# Altium project ECU.PrjPcb (part 1 of 2)
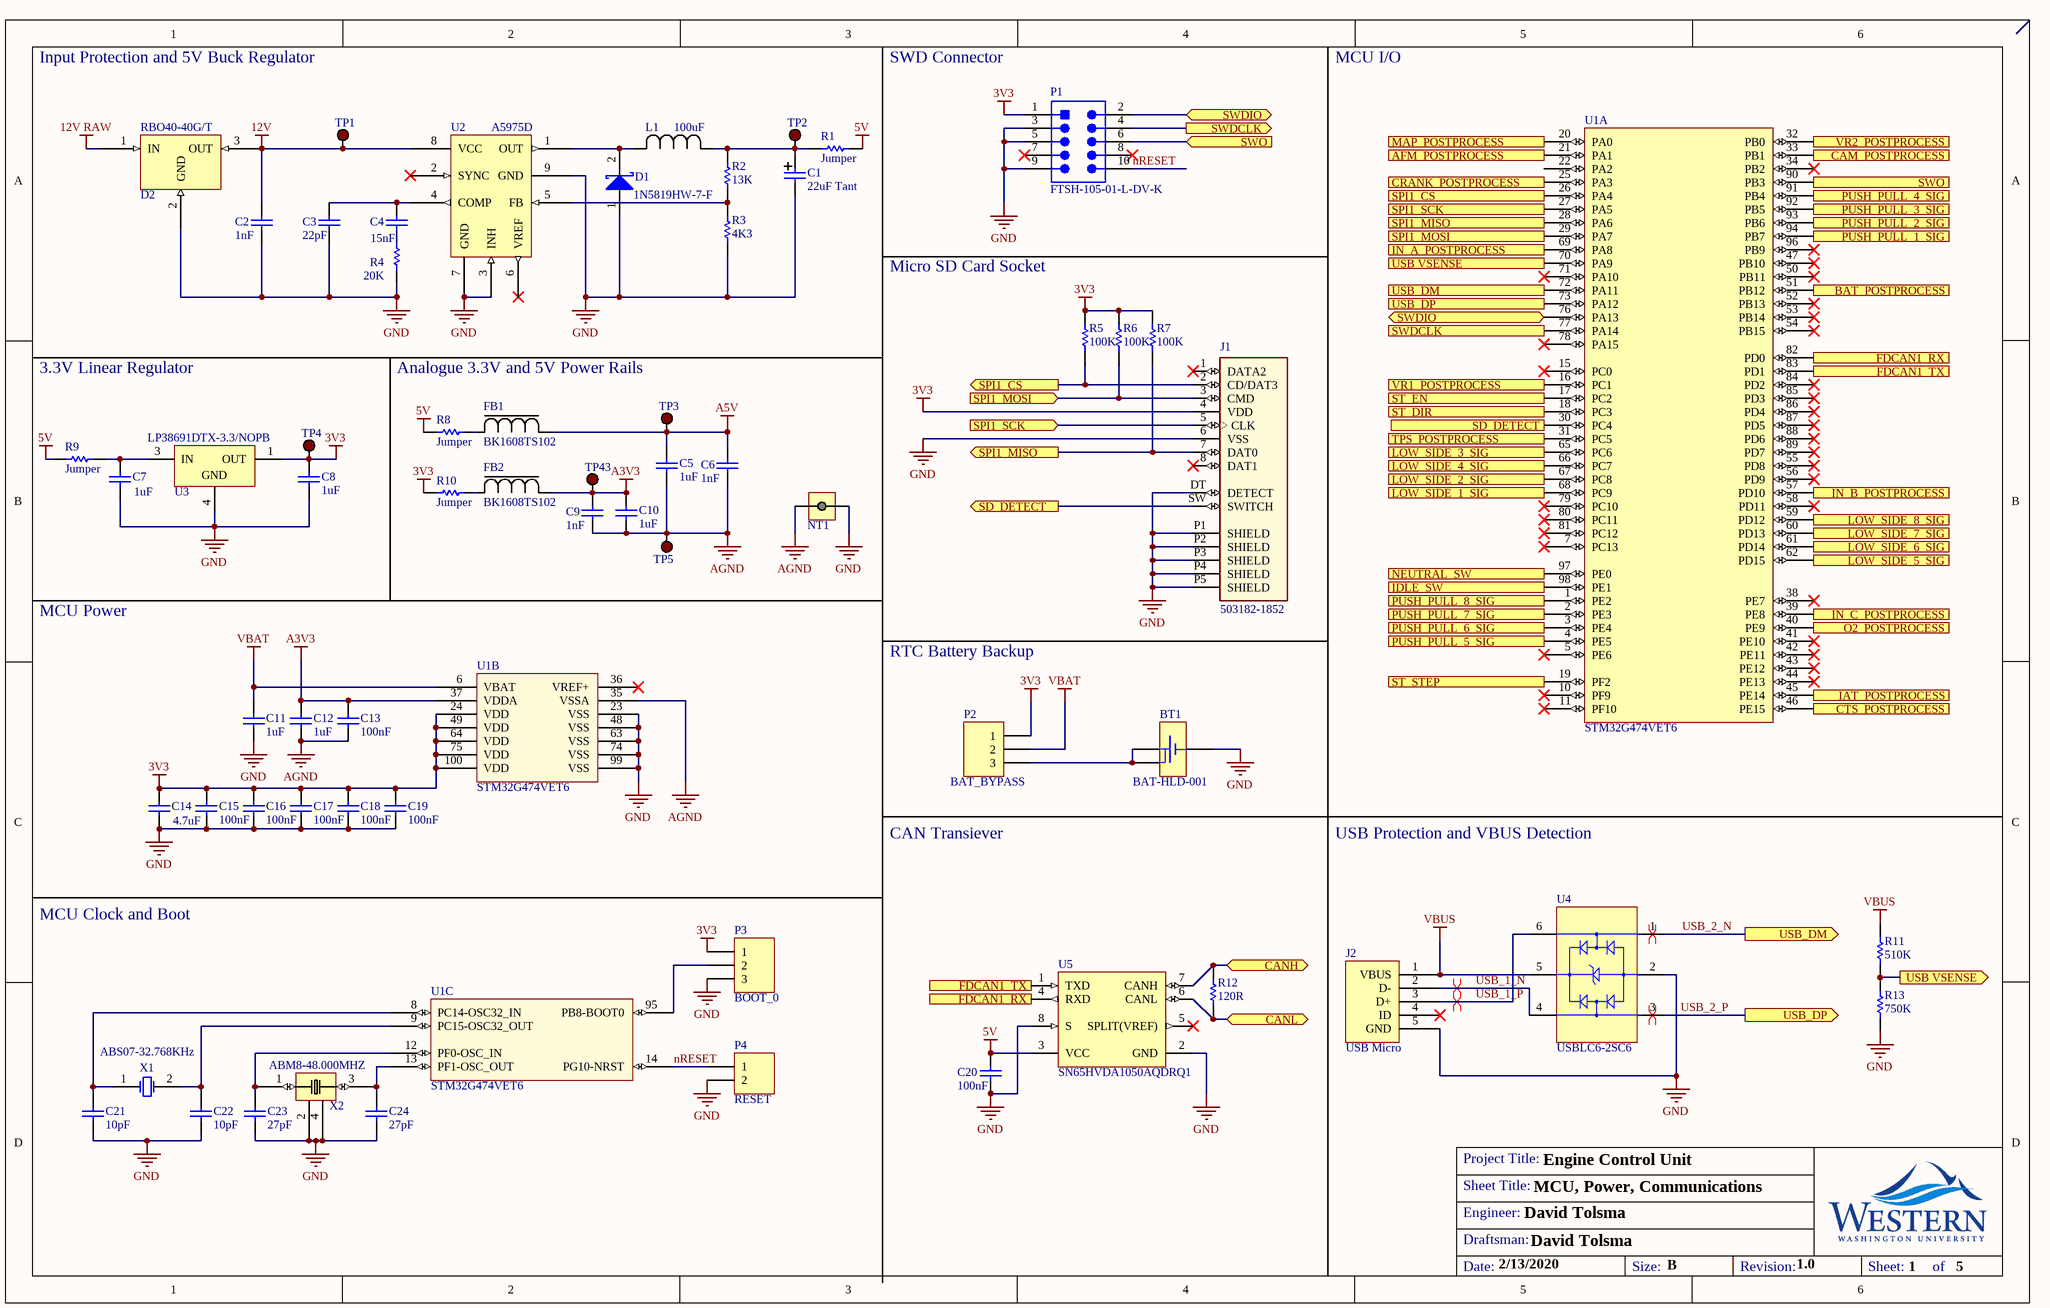
[diagram p0: Power_Communications_MCU.SchDoc]
DraftsmanName: David Tolsma; EngineerName: David Tolsma; GlobalDate: 2/13/2020; GlobalTitle: Engine Control Unit; RevNumber: 1.0
5 sheets, 338 parts. Net scope: global (net labels, ports and power ports of the same name join across sheets).
Board file: ECU.PcbDoc
Sheets:
  Power_Communications_MCU.SchDoc
  Low_Side_Drivers.SchDoc
  Op_Amp_Sig_Process.SchDoc
  Push_Pull_Drivers.SchDoc
  Op_Amp_Sig_Process_Off-Board_Connector_Etc.SchDoc

## Sheet Power_Communications_MCU.SchDoc: MCU, Power, Communications
size B; Date: [Date]; SheetNumber: 1; SheetTotal: 5

### Parts
BT1  BAT-HLD-001  [BATHLD-001]
C1  22uF Tant  [CAPC1210(3225)280_L]
C2  1nF  [CAPC0603(1608)100_N]
C3  22pF  [CAPC0603(1608)100_M]
C4  15nF  [CAPC0603(1608)100_M]
C5  1uF  [CAPC0603(1608)100_M]
C6  1nF  [CAPC0603(1608)100_M]
C7  1uF  [CAPC0603(1608)100_M]
C8  1uF  [CAPC0603(1608)100_M]
C9  1nF  [CAPC0603(1608)100_M]
C10  1uF  [CAPC0603(1608)100_M]
C11  1uF  [CAPC0603(1608)100_L]
C12  1uF  [CAPC0603(1608)100_L]
C13  100nF  [CAPC0603(1608)100_L]
C14  4.7uF  [CAPC0603(1608)55_L]
C15  100nF  [CAPC0603(1608)100_L]
C16  100nF  [CAPC0603(1608)100_L]
C17  100nF  [CAPC0603(1608)100_L]
C18  100nF  [CAPC0603(1608)100_L]
C19  100nF  [CAPC0603(1608)100_L]
C20  100nF  [CAPC0603(1608)100_M]
C21  10pF  [CAPC0603(1608)100_L]
C22  10pF  [CAPC0603(1608)100_L]
C23  27pF  [CAPC0603(1608)100_M]
C24  27pF  [CAPC0603(1608)100_M]
D1  1N5819HW-7-F  [DIOD-SOD-123-2_V]
D2  RBO40-40G/T  [D2PAK-L]
FB1  BK1608TS102  [BK1608TS102-T]
FB2  BK1608TS102  [BK1608TS102-T]
J1  503182-1852  [*MOLEX_503182-1852_503182-1852(Primary)]
J2  USB Micro  [USB_CONN]
L1  100uF  [IND_BOURNS_SRR1260-101M]
NT1  NET TIE 0603  [NetTie0603]  (value not drawn)  (net tie, no BOM)
P1  FTSH-105-01-L-DV-K  [SMTC-FTSH-105-01-L-DV-K_V]
P2  BAT_BYPASS  [HDR1X3]
P3  BOOT_0  [HDR1X3]
P4  RESET  [HDR1X2]
R1  Jumper  [RESC0603(1608)_N]
R2  13K  [RESC0603(1608)_M]
R3  4K3  [RESC0603(1608)_M]
R4  20K  [RESC0603(1608)_M]
R5  100K  [RESC0603(1608)_N]
R6  100K  [RESC0603(1608)_N]
R7  100K  [RESC0603(1608)_N]
R8  Jumper  [RESC0603(1608)_N]
R9  Jumper  [RESC0603(1608)_M]
R10  Jumper  [RESC0603(1608)_N]
R11  510K  [RESC0603(1608)_M]
R12  120R  [RESC0603(1608)_L]
R13  750K  [RESC0603(1608)_M]
TP1  5001  [Keystone_5001]  (value not drawn)
TP2  5001  [Keystone_5001]  (value not drawn)
TP3  5001  [Keystone_5001]  (value not drawn)
TP4  5001  [Keystone_5001]  (value not drawn)
TP5  5001  [Keystone_5001]  (value not drawn)
TP43  5001  [Keystone_5001]  (value not drawn)
U1  STM32G474VET6  [STM32G474VET6]  (parts A,B,C of 3)
U2  A5975D  [A5975D_Medium_Density]
U3  LP38691DTX-3.3/NOPB  [TD03B_M]
U4  USBLC6-2SC6  [USBLC6-2SC6]
U5  SN65HVDA1050AQDRQ1  [D8_L]
X1  ABS07-32.768KHz  [ABRA-ABS07-2_V]
X2  ABM8-48.000MHZ  [ABM8-48.000MHZ-10-1-U-T]

### Ports
AFM_POSTPROCESS (in), BAT_POSTPROCESS (in), CAM_POSTPROCESS (in), CANH (bidir), CANL (bidir), CRANK_POSTPROCESS (in), CTS_POSTPROCESS (in), FDCAN1_RX (in), FDCAN1_RX (out), FDCAN1_TX (in), FDCAN1_TX (out), IAT_POSTPROCESS (in), IDLE_SW (out), IN_A_POSTPROCESS (in), IN_B_POSTPROCESS (in), IN_C_POSTPROCESS (in), LOW_SIDE_1_SIG (out), LOW_SIDE_2_SIG (out), LOW_SIDE_3_SIG (out), LOW_SIDE_4_SIG (out), LOW_SIDE_5_SIG (out), LOW_SIDE_6_SIG (out), LOW_SIDE_7_SIG (out), LOW_SIDE_8_SIG (out), MAP_POSTPROCESS (in), NEUTRAL_SW (out), O2_POSTPROCESS (in), PUSH_PULL_1_SIG (out), PUSH_PULL_2_SIG (out), PUSH_PULL_3_SIG (out), PUSH_PULL_4_SIG (out), PUSH_PULL_5_SIG (out), PUSH_PULL_6_SIG (out), PUSH_PULL_7_SIG (out), PUSH_PULL_8_SIG (out), SD_DETECT (in), SD_DETECT (out), SPI1_CS (out), SPI1_MISO (in), SPI1_MISO (out), SPI1_MOSI (in), SPI1_MOSI (out), SPI1_SCK (in), SPI1_SCK (out), ST_DIR (out), ST_EN (out), ST_STEP (out), SWDCLK (in), SWDCLK (out), SWDIO (bidir), SWO (in), SWO (out), TPS_POSTPROCESS (in), USB VSENSE (in), USB VSENSE (out), USB_DM (out), USB_DP (out), VR1_POSTPROCESS (in), VR2_POSTPROCESS (in)

### Nets
3V3: C8.2 C14.2 C15.2 C16.2 C17.2 C18.2 C19.2 J1.4(VDD) P1.1 P2.1 P3.1 R5.2 R6.2 R7.2 R10.1 TP4.1(TP) U1.24(VDD) U1.49(VDD) U1.64(VDD) U1.75(VDD) U1.100(VDD) U3.1(OUT)
5V: C20.2 R1.2 R8.1 R9.1 U5.3(VCC)
12V: C2.1 D2.3(OUT) TP1.1(TP) U2.8(VCC)
12V RAW: D2.1(IN)
A3V3: C9.1 C10.2 C12.2 C13.2 FB2.1 TP43.1(TP) U1.37(VDDA)
A5V: C5.2 C6.1 FB1.1 TP3.1(TP)
AGND: C5.1 C6.2 C9.2 C10.1 C12.1 C13.1 NT1.1 TP5.1(TP) U1.35(VSSA)
GND: BT1.1(-) C1.1 C2.2 C3.1 C7.1 C8.1 C11.1 C14.1 C15.1 C16.1 C17.1 C18.1 C19.1 C20.1 C21.1 C22.1 C23.1 C24.1 D1.1(A) D2.2(GND) J1.6(VSS) J1.DT(DETECT) J1.P1(SHIELD) J1.P2(SHIELD) J1.P3(SHIELD) J1.P4(SHIELD) J1.P5(SHIELD) J2.5(GND) NT1.2 P1.3 P1.5 P1.9 P3.3 P4.2 R3.2 R4.1 R13.1 U1.23(VSS) U1.48(VSS) U1.63(VSS) U1.74(VSS) U1.99(VSS) U2.3(INH) U2.7(GND) U2.9(GND) U3.4(GND) U4.2(GND) U5.2(GND) U5.8(S) X2.2 X2.4
VBAT: C11.2 P2.2 U1.6(VBAT)
VBUS: J2.1(VBUS) R11.2 U4.5(VBUS)
nRESET: P1.10 P4.1 U1.14(PG10-NRST)
USB_1_N: J2.2(D-) U4.4(I/O_3)
USB_1_P: J2.3(D+) U4.6(I/O_4)
USB_2_N: U1.72(PA11) U4.1(I/O_1) ; port USB_DM
USB_2_P: U1.73(PA12) U4.3(I/O_2) ; port USB_DP
NetBT1_2: BT1.2(+) BT1.3(+) P2.3
NetC1_2: C1.2 L1.1 R1.1 R2.2 TP2.1(TP)
NetC3_2: C3.2 C4.2 U2.4(COMP)
NetC4_1: C4.1 R4.2
NetC7_2: C7.2 R9.2 U3.3(IN)
NetC21_2: C21.2 U1.8(PC14-OSC32_IN) X1.1(X1)
NetC22_2: C22.2 U1.9(PC15-OSC32_OUT) X1.2(X2)
NetC23_2: C23.2 U1.12(PF0-OSC_IN) X2.1
NetC24_2: C24.2 U1.13(PF1-OSC_OUT) X2.3
NetD1_2: D1.2(K) L1.2 U2.1(OUT)
NetD38_3: U1.97(PE0) ; port NEUTRAL_SW
NetD40_3: U1.98(PE1) ; port IDLE_SW
NetFB1_2: FB1.2 R8.2
NetFB2_2: FB2.2 R10.2
NetJ1_2: J1.2(CD/DAT3) R5.1 U1.26(PA4) ; port SPI1_CS
NetJ1_3: J1.3(CMD) R6.1 U1.29(PA7) ; port SPI1_MOSI
NetJ1_5: J1.5(CLK) U1.27(PA5) ; port SPI1_SCK
NetJ1_7: J1.7(DAT0) R7.1 U1.28(PA6) ; port SPI1_MISO
NetJ1_SW: J1.SW(SWITCH) U1.30(PC4) ; port SD_DETECT
NetP1_2: P1.2 U1.76(PA13) ; port SWDIO
NetP1_4: P1.4 U1.77(PA14) ; port SWDCLK
NetP1_6: P1.6 U1.90(PB3) ; port SWO
NetP3_2: P3.2 U1.95(PB8-BOOT0)
NetR2_1: R2.1 R3.1 U2.5(FB)
NetR11_1: R11.1 R13.2 U1.70(PA9) ; port USB VSENSE
NetR12_1: R12.1 U5.6(CANL) ; port CANL
NetR12_2: R12.2 U5.7(CANH) ; port CANH
NetR20_2: U1.68(PC9) ; port LOW_SIDE_1_SIG
NetR21_2: U1.65(PC6) ; port LOW_SIDE_3_SIG
NetR24_2: U1.67(PC8) ; port LOW_SIDE_2_SIG
NetR25_2: U1.66(PC7) ; port LOW_SIDE_4_SIG
NetR36_2: U1.62(PD15) ; port LOW_SIDE_5_SIG
NetR37_2: U1.60(PD13) ; port LOW_SIDE_7_SIG
NetR40_2: U1.61(PD14) ; port LOW_SIDE_6_SIG
NetR41_2: U1.59(PD12) ; port LOW_SIDE_8_SIG
NetR50_2: U1.31(PC5) ; port TPS_POSTPROCESS
NetR51_2: U1.33(PB1) ; port CAM_POSTPROCESS
NetR60_2: U1.25(PA3) ; port CRANK_POSTPROCESS
NetR61_2: U1.20(PA0) ; port MAP_POSTPROCESS
NetR70_2: U1.45(PE14) ; port IAT_POSTPROCESS
NetR71_2: U1.21(PA1) ; port AFM_POSTPROCESS
NetR80_2: U1.46(PE15) ; port CTS_POSTPROCESS
NetR81_2: U1.40(PE9) ; port O2_POSTPROCESS
NetR90_2: U1.94(PB7) ; port PUSH_PULL_1_SIG
NetR91_2: U1.92(PB5) ; port PUSH_PULL_3_SIG
NetR98_2: U1.93(PB6) ; port PUSH_PULL_2_SIG
NetR99_2: U1.91(PB4) ; port PUSH_PULL_4_SIG
NetR106_2: U1.4(PE5) ; port PUSH_PULL_5_SIG
NetR107_2: U1.2(PE3) ; port PUSH_PULL_7_SIG
NetR114_2: U1.3(PE4) ; port PUSH_PULL_6_SIG
NetR115_2: U1.1(PE2) ; port PUSH_PULL_8_SIG
NetR119_1: U1.16(PC1) ; port VR1_POSTPROCESS
NetR122_1: U1.32(PB0) ; port VR2_POSTPROCESS
NetR125_2: U1.51(PB12) ; port BAT_POSTPROCESS
NetR136_2: U1.69(PA8) ; port IN_A_POSTPROCESS
NetR141_2: U1.57(PD10) ; port IN_B_POSTPROCESS
NetR148_2: U1.39(PE8) ; port IN_C_POSTPROCESS
NetU1_17: U1.17(PC2) ; port ST_EN
NetU1_18: U1.18(PC3) ; port ST_DIR
NetU1_19: U1.19(PF2) ; port ST_STEP
NetU1_82: U1.82(PD0) U5.4(RXD) ; port FDCAN1_RX
NetU1_83: U1.83(PD1) U5.1(TXD) ; port FDCAN1_TX

Not connected (* = marked no-connect by the designer): J1 1(DATA2)* 8(DAT1)*; J2 4(ID)*; P1 7* 8*; U1 5(PE6)* 7(PC13)* 10(PF9)* 11(PF10)* 15(PC0)* 22(PA2) 34(PB2)* 36(VREF+)* 38(PE7)* 41(PE10)* 42(PE11)* 43(PE12)* 44(PE13)* 47(PB10)* 50(PB11)* 52(PB13)* 53(PB14)* 54(PB15)* 55(PD8)* 56(PD9)* 58(PD11)* 71(PA10)* 78(PA15)* 79(PC10)* 80(PC11)* 81(PC12)* 84(PD2)* 85(PD3)* 86(PD4)* 87(PD5)* 88(PD6)* 89(PD7)* 96(PB9)*; U2 2(SYNC)* 6(VREF)*; U5 5(SPLIT(VREF))*

### Layout directives
differential pair: USB_1_N, USB_1_P, USB_2_N, USB_2_P

### Notes on the sheet
- Input Protection and 5V Buck Regulator
- SWD Connector
- MCU I/O
- Micro SD Card Socket
- 3.3V Linear Regulator
- Analogue 3.3V and 5V Power Rails
- MCU Power
- RTC Battery Backup
- CAN Transiever
- USB Protection and VBUS Detection
- MCU Clock and Boot
- Sheet Title:
- Project Title:
- Engineer:
- Draftsman:
- Date:
- Size:
- B
- Revision:
- Sheet:        of

### Library data of the parts
BT1 = CMP-0168-00043-1: 20mm Coin Cell Battery Holder; PCB_Layout: Complies with manufacturer's recommendation.; DatasheetVersion: rev1.0, Dec-2007; PackageVersion: rev1.0, Dec-2007; PackageReference: BATHLD-001; PackageDescription: Low Profile SM Battery Holder, 20mm Lithium Cell, 21.1 x 15.3 x 4.2 mm Body
C1 = CMP-1038-02268-1: 22uF 10V 1210 (3225 Metric) SMD; Case-Metric: 3225; Case-EIA: 1210; Tolerance: Â±10%; Max Thickness: 2.8 mm; Value: 22uF; Technology: SMT; Rated Voltage: 10 V
C2 = CMP-1035-01887-1: 1nF 50V 0603 (1608 Metric); Case-EIA: 0603; Case-Metric: 1608; Tolerance: Â±2%; Max Thickness: 1 mm; Rated Voltage: 50 V; Value: 1nF; Technology: SMT
C3 = CMP-1035-00822-1: 22pF 50V 0603 (1608 Metric); Case-Metric: 1608; Tolerance: Â±10%; Case-EIA: 0603; Technology: SMT; Max Thickness: 1 mm; Rated Voltage: 50 V; Value: 22pF
C4 = CMP-1035-02380-1: 15nF 50V 0603 (1608 Metric); Case-Metric: 1608; Case-EIA: 0603; Tolerance: Â±5%; Technology: SMT; Max Thickness: 1 mm; Value: 15nF; Rated Voltage: 50 V
C5 C10-C12 = CMP-1035-02733-1: CAP 1uF 10V ±10% 0603 (1608 Metric) Thickness 1mm SMD; Tolerance: Â±10%; Case-EIA: 0603; Case-Metric: 1608; Rated Voltage: 10 V; Max Thickness: 1 mm; Value: 1uF; Technology: SMT
C6 C9 = CMP-1035-01887-1: CAP 1nF 50V ±2% 0603 (1608 Metric) Thickness 1mm SMD; Case-EIA: 0603; Case-Metric: 1608; Tolerance: Â±2%; Max Thickness: 1 mm; Rated Voltage: 50 V; Value: 1nF; Technology: SMT
C7 C8 = CMP-1035-02745-1: CAP 1uF 50V ±10% 0603 (1608 Metric) Thickness 1mm SMD; Case-EIA: 0603; Case-Metric: 1608; Tolerance: Â±10%; Technology: SMT; Value: 1uF; Rated Voltage: 50 V; Max Thickness: 1 mm
C13 C15-C20 = CMP-1035-02580-1: CAP 100nF 10V ±10% 0603 (1608 Metric) Thickness 1mm SMD; Tolerance: Â±10%; Case-EIA: 0603; Case-Metric: 1608; Max Thickness: 1 mm; Value: 100nF; Rated Voltage: 10 V; Technology: SMT
C14 = CMP-1035-02784-1: CAP 4.7uF 10V ±10% 0603 (1608 Metric) Thickness 0.55mm SMD; Case-Metric: 1608; Tolerance: Â±10%; Case-EIA: 0603; Technology: SMT; Max Thickness: 0.55 mm; Value: 4.7uF; Rated Voltage: 10 V
C21 C22 = CMP-1035-00556-1: CAP 10pF 50V ±1% 0603 (1608 Metric) Thickness 1mm SMD; Case-Metric: 1608; Case-EIA: 0603; Tolerance: Â±1%; Technology: SMT; Max Thickness: 1 mm; Rated Voltage: 50 V; Value: 10pF
C23 C24 = CMP-1035-00886-1: CAP 27pF 50V ±1% 0603 (1608 Metric) Thickness 1mm SMD; Case-Metric: 1608; Case-EIA: 0603; Tolerance: Â±1%; Technology: SMT; Max Thickness: 1 mm; Value: 27pF; Rated Voltage: 50 V
D1 = CMP-0303-00003-1: 1.0 A Surface Mount Schottky Barrier Rectifier; Manufacturer: Diodes Inc; @ VR (V): 40; @ Terminal Temperature TT (degC): 90; Maximum Average Rectified Current IO (A): 1; Total Capacitance CT (pF): 50; Peak Forward Surge Current IFSM (A): 25; Forward Voltage Drop VF (V): 0.45; Packing: Tape and Reel; VR (RMS) (V): 28; RoHS: TRUE; PartNumber: 1N5819HW-7-F; ComponentLink2URL: http://www.diodes.com/datasheets/ds30217.pdf; PackageDescription: 2-Pin SOD-123, Body 2.7 x 1.55 mm, Pitch 3.7 mm; @ IF (A): 1; Operating and Storage Temperature Range: -65 to 125 degC; ComponentLink1Description: Manufacturer URL; ComponentLink2Description: Datasheet; ComponentLink1URL: http://www.diodes.com/; Mounting Technology: Surface Mount; DatasheetVersion: Rev. 15-2; PackageReference: SOD-123-2; Maximum Reverse Current IR (uA): 50; Peak Repetitive Reverse Voltage VRRM (V): 40
D2 = RBO40-40G/T: Designed to protect against battery reversal andload dump overvoltages in automotive applica-tions, this monolithic component offers multiplefunctions in the same package.
J1 = 503182-1852: 10 _8 + 2_ Position Card Connector microSDâ„¢ Surface Mount, Right Angle Gold; MF: Molex; MP: 5031821852; Digi-Key_Part_Number: WM12834CT-ND; Digi-Key_Purchase_URL: https://www.digikey.com/product-detail/en/molex/5031821852/WM12834CT-ND/5823232?utm_source=snapeda&utm_medium=aggregator&utm_campaign=symbol; Package: None; SnapEDA_Link: https://www.snapeda.com/parts/5031821852/Molex/view-part/46835/?ref=snap; Value: *
J2 = USB MICRO CONN SMT R/A (Amphenol): Micro USB R/A SMT CONNECTOR; Supplier 1: Digi-Key; Supplier Part Number 1: 609-4618-1-ND
L1 = SRR1260-101M: SRR1260-101M - 100uH; Vendor: Bourns Electronics; Built_By: EMA_UL_Team; Type: DEV; Manufacturer_Part_Number: SRR1260-101M; Copyright: Copyright (C) 2018 Accelerated Designs. All rights reserved; RefDes: RefDes; Value: Value
NT1 = NET TIE
P1 = CMP-2000-05353-1: Male Header, Pitch 1.27 mm, 2 x 5 Position, Height 6.25 mm; Manufacturer: Samtec; Pitch: 0.050"(1.27mm); Other Names: Q3937619; Number of Positions: 10; Mating Products: SFMC-105-L2-S-D-TR-ND / -CONN.05"SURFACE10POSSMT / FLE-105-01-G-DV-TR-ND / -CONNSKT1.27MM10POSDUALSMD / FLE-105-01-G-DV-A-P-ND / -CONNSKT1.27MM10POSDUALSMD / FLE-105-01-G-DV-A-ND / -CONNSKT1.27MM10POSDUALSMD / CLP-105-02-G-D-P-TR-ND / -CONNRCPT10POSDUAL.05"SMD / SAM1155-05-ND / -CONNRCPT10POSDUAL.05"SMD / SAM1154-05-ND / -CONNRCPT10POSDUAL.05"SMD / SAM1153-05-ND / -CONNRCPT10POSDUAL.05"SMD / SAM1226-05-ND / -CONNRCPT.05"10POSDUALSMD; Number of Positions Loaded: All; Connector Type: Header,Unshrouded; Product Training Modules: Board-to-BoardConnectors; Datasheet Version: Rev. ET, 10/1995; Number of Rows: 2; Standard Package: 1; Package Description: Male Header, Pitch 1.27 mm, 2 x 5 Position, Height 5.97 mm, Tail Length 4.32 mm; Contact Finish Thickness: 10µin(0.25µm); Series: FTSH; Termination: Solder; Contact Type: MalePin; Color: Black; Package Reference: FTSH-105-01-L-DV-K; Family: RectangularConnectors-Headers,MalePins; Package URL: http://suddendocs.samtec.com/prints/ftsh-1xx-xx-xxx-dv-xxx-footprint.pdf; Packaging: Tube; Mounting Type: SurfaceMount; Category: Connectors,Interconnects; Datasheet URL: http://suddendocs.samtec.com/prints/ftsh-1xx-xx-xxx-dv-xxx-mkt.pdf; Row Spacing: 0.050"(1.27mm); Manufacturer URL: http://www.samtec.com/; Contact Mating Length: 0.120"(3.05mm); Contact Finish: Gold
P2 P3 = Header 3: Header, 3-Pin; LatestRevisionDate: 17-Jul-2002; LatestRevisionNote: Re-released for DXP Platform.; Publisher: Altium Limited
P4 = Header 2: Header, 2-Pin; LatestRevisionDate: 17-Jul-2002; LatestRevisionNote: Re-released for DXP Platform.; Publisher: Altium Limited
R1 R8-R10 = CMP-1012-00001-1: Jumper 0603 (1608 Metric); Case-Metric: 1608; Value: 0.00 Ohm; Power: None; Case-EIA: 0603; Technology: SMT; Tolerance: None
R2 = CMP-1012-00635-1: 13K 0.1W 1% 0603 (1608 Metric)  SMD; Case-EIA: 0603; Value: 13000.00 Ohm; Case-Metric: 1608; Tolerance: 1 %; Technology: SMT; Power: 0.1 W
R3 = CMP-1012-00581-1: 4K3 0.1W 1% 0603 (1608 Metric)  SMD; Case-Metric: 1608; Value: 4300.00 Ohm; Case-EIA: 0603; Power: 0.1 W; Tolerance: 1 %; Technology: SMT
R4 = CMP-1012-00655-1: 20K 0.1W 1% 0603 (1608 Metric)  SMD; Case-Metric: 1608; Case-EIA: 0603; Value: 20000.00 Ohm; Technology: SMT; Tolerance: 1 %; Power: 0.1 W
R5-R7 = CMP-1012-00736-1: 100K 0.1W 1% 0603 (1608 Metric)  SMD; Value: 100000.00 Ohm; Case-Metric: 1608; Case-EIA: 0603; Power: 0.1 W; Tolerance: 1 %; Technology: SMT
R11 = CMP-1012-00816-1: 510K 0.1W 1% 0603 (1608 Metric)  SMD; Value: 510000.00 Ohm; Case-EIA: 0603; Case-Metric: 1608; Tolerance: 1 %; Technology: SMT; Power: 0.1 W
R12 = CMP-1012-00052-1: 120R 0.1W 5% 0603 (1608 Metric)  SMD; Case-EIA: 0603; Value: 120.00 Ohm; Case-Metric: 1608; Technology: SMT; Power: 0.1 W; Tolerance: 5 %
R13 = CMP-1012-00835-1: 750K 0.1W 1% 0603 (1608 Metric)  SMD; Case-Metric: 1608; Case-EIA: 0603; Value: 750000.00 Ohm; Tolerance: 1 %; Technology: SMT; Power: 0.1 W
TP1-TP5 TP43 = TEST POINT: TEST POINT PC MINI .040"D BLACK; Manufacturer: Keystone Electronics; Supplier 1: Digi-Key; Manufacturer Part Number: 5001; RoHS: RoHS Compliant; Category: Test and Measurement; Stock 1: 7538; Pricing 1: 1=0.34, 10=0.315, 50=0.2296, 100=0.2206, 250=0.19812, 500=0.1891, 1000=0.15759, 2500=0.14408, 5000=0.13508 (USD); Packaging: Bulk; Type: PC Test Point, Miniature; Terminal: 0.010" x 0.020" (0.25mm x 0.51mm) Phosphor Bronze Wire, Silver Plated; Mounting Type: 0.040" (1.02mm) Hole Diameter; Material: Base, Nylon 46, UL 94V-0; Color: Black; ComponentLink1URL: http://www.keyelco.com/product-pdf.cfm?p=1310; ComponentLink1Description: http://www.keyelco.com/product-pdf.cfm?p=1310; Supplier Part Number 1: 5001K-ND
U1 = STM32G474VET6_1
U2 = A5975D: The A5975D is a step-down monolithic power / switching regulator with a minimum switch current / limit of 3.75 A, it is therefore able to deliver up to 3 / A DC current to the load depending on the / application conditions. The output voltage can be / set from 1.235 V to 35 V. The high current level is / also achieved thanks to a HSOP8 package with / exposed frame, that allows to reduce the RTHJ-A / down to approximately 40 °C/W. The device uses / an internal P-channel DMOS transistor (with a / typical RDS(on) of 250 mΩ) as switching element / to minimize the size of the external components. / An internal oscillator fixes the switching frequency / at 250 kHz. Having a minimum input voltage of / only 4 V, it fits automotive applications requiring / device operation even in cold crank conditions. / Pulse-by-pulse current limit with the internal / frequency modulation offers an effective constant / current short-circuit protection.; ComponentLink1Description: STMicro; ComponentLink1URL: https://www.st.com/en/power-management/a5975d.html#resource
U3 = CMP-0062-02610-1: 500mA Low Dropout CMOS Linear Regulators Stable with Ceramic Output Capacitors, 3-pin TO-252, 2500 Reel; Manufacturer: National Semiconductor; High-Reliability: Y; CompType: LDO IC; RoHS: Y; Code_JEDEC: TO-252-AA; ComponentLink3URL: http://www.national.com/pf/LP/LP38691.html; DatasheetVersion: Jun-2011; PackageVersion: revD, Feb-2009; ComponentLink4URL: http://www.national.com/packaging/folders/td03b.html; ComponentLink4Description: TD03B Package Page; PinCount: 3; ComponentLink2Description: LP38691 Datasheet; ComponentLink3Description: LP38691 Web Page; ComponentLink2URL: http://www.national.com/ds/LP/LP38691.pdf; PackageReference: TD03B; ComponentLink1URL: http://www.national.com/; PowerWise: Y; PackageDescription: TO252, Molded, Jedec, 6.8 x 6.10 x 2.30mm Body, 3 Lead, 2.28mm Pitch, Surface Mount; ComponentLink1Description: Manufacturer URL; PartNumber: LP38691DTX-3.3/NOPB
U5 = CMP-0315-00008-1: Automotive Catalog EMC-Optimized High-Speed CAN Transceiver, 70 mA, 5 V, -40 to 125 degC, 8-pin SOIC (D), Green (RoHS & no Sb/Br); Manufacturer: Texas Instruments; Receivers Per Package: 1; Bus Fault Voltage(V): -27 to 40; Supply Voltage(s)(V): 5; ICC(Max)(mA): 70; Transient Pulse Protection(V): -200 to 200; ComponentLink1Description: Datasheet; PackageVersion: revM, Jun-2011; ComponentLink1URL: http://www.ti.com/general/docs/lit/getliterature.tsp?genericPartNumber=SN65HVDA1050A-Q1&fileType=pdf; Mounting Technology: Surface Mount; SubFamily: CAN; Drivers Per Package: 1; Code_JEDEC: MS-012AA; Eco-Plan: Green (RoHS & no Sb/Br); Rating: Automotive; PackageReference: D8; Isolated: No; PartNumber: SN65HVDA1050AQDRQ1; DatasheetVersion: SLLS994A; PackageDescription: 8-Pin Plastic Small Outline Integrated Circuit, 4.9 x 3.9 mm, Pitch 1.27 mm Pitch
X1 = CMP-0447-00001-2: Crystal, 32.768 kHz, 12.5 pF, -40 to 85 degC, SMD Low Profile 3.2 x 1.5 x 0.9 mm, Tape and Reel; Manufacturer: Abracon; PartNumber: ABS07-32.768KHz-T; Q Value (Type): 30000; Operation Mode: Flexural Mode (Tuning Fork); Shunt Capacitance (C0): 0.9 to 1.2 pF; Load Capacitance (CL): 12.5 pF; Frequency Tolerance @+25degC: +/- 20 ppm; Drive Level (Type): 0.1 uW; Equivalent Series Resistance (R1): 70 Kohm; Insulation Resistance (Min): 500 Mohm; ComponentLink3URL: http://www.abracon.com/Resonators/ABS07.pdf; PackageDescription: 2-Pin Hand Drawn, Body 3.2x1.5mm, Pitch 2.5mm; Operating Temperature: -40 to 85 degC; ComponentLink2URL: http://www.abracon.com/Resonators/ABS07.pdf; PackageReference: ABS07-2; ComponentLink3Description: Package Specification; ComponentLink1Description: Manufacturer URL; DatasheetVersion: 04.03.13; Mounting Technology: Surface Mount; ComponentLink2Description: Datasheet; ComponentLink1URL: http://www.abracon.com/; Packing: Tape and Reel; Frequency: 32.768 kHz
X2 = ABM8-48.000MHZ-10-1-U-T

## Sheet Low_Side_Drivers.SchDoc: Low Side Drivers
size B; SheetNumber: 2; SheetTotal: 5
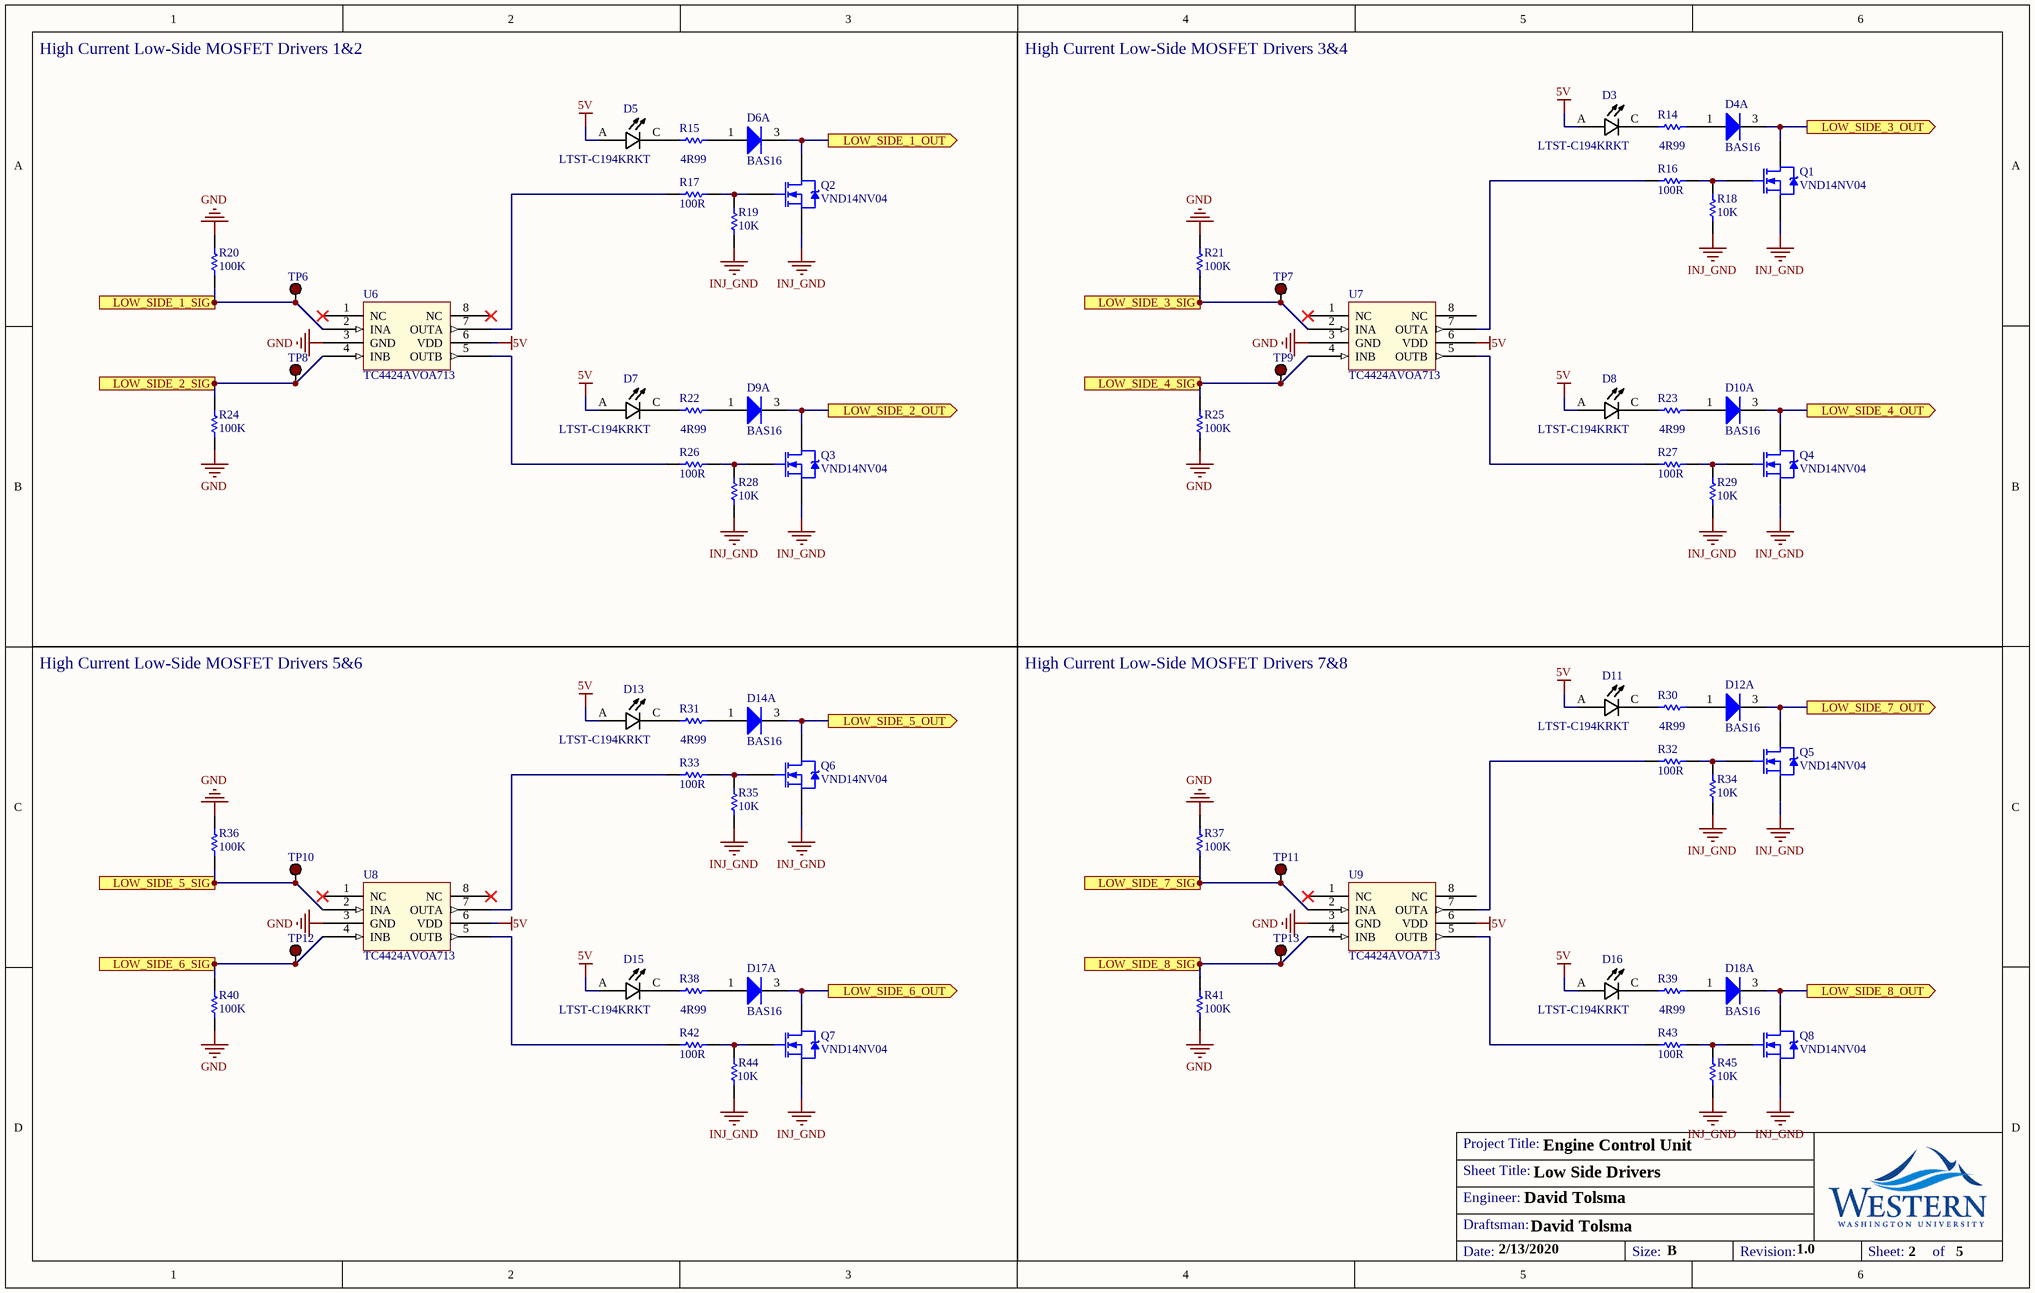
[diagram p1: Low_Side_Drivers.SchDoc]

### Parts
D3  LTST-C194KRKT  [LEDC1608X35N_LTST-C194KRKT]
D4  BAS16  [NXP-SOT23-3_V]  (part A of 2)
D5  LTST-C194KRKT  [LEDC1608X35N_LTST-C194KRKT]
D6  BAS16  [NXP-SOT23-3_V]  (part A of 2)
D7  LTST-C194KRKT  [LEDC1608X35N_LTST-C194KRKT]
D8  LTST-C194KRKT  [LEDC1608X35N_LTST-C194KRKT]
D9  BAS16  [NXP-SOT23-3_V]  (part A of 2)
D10  BAS16  [NXP-SOT23-3_V]  (part A of 2)
D11  LTST-C194KRKT  [LEDC1608X35N_LTST-C194KRKT]
D12  BAS16  [NXP-SOT23-3_V]  (part A of 2)
D13  LTST-C194KRKT  [LEDC1608X35N_LTST-C194KRKT]
D14  BAS16  [NXP-SOT23-3_V]  (part A of 2)
D15  LTST-C194KRKT  [LEDC1608X35N_LTST-C194KRKT]
D16  LTST-C194KRKT  [LEDC1608X35N_LTST-C194KRKT]
D17  BAS16  [NXP-SOT23-3_V]  (part A of 2)
D18  BAS16  [NXP-SOT23-3_V]  (part A of 2)
Q1  VND14NV04  [VND14NV04]
Q2  VND14NV04  [VND14NV04]
Q3  VND14NV04  [VND14NV04]
Q4  VND14NV04  [VND14NV04]
Q5  VND14NV04  [VND14NV04]
Q6  VND14NV04  [VND14NV04]
Q7  VND14NV04  [VND14NV04]
Q8  VND14NV04  [VND14NV04]
R14  4R99  [RESC0603(1608)_M]
R15  4R99  [RESC0603(1608)_M]
R16  100R  [RESC1206(3216)_L]
R17  100R  [RESC1206(3216)_L]
R18  10K  [RESC0603(1608)_M]
R19  10K  [RESC0603(1608)_M]
R20  100K  [RESC0603(1608)_M]
R21  100K  [RESC0603(1608)_M]
R22  4R99  [RESC0603(1608)_M]
R23  4R99  [RESC0603(1608)_M]
R24  100K  [RESC0603(1608)_M]
R25  100K  [RESC0603(1608)_M]
R26  100R  [RESC1206(3216)_L]
R27  100R  [RESC1206(3216)_L]
R28  10K  [RESC0603(1608)_M]
R29  10K  [RESC0603(1608)_M]
R30  4R99  [RESC0603(1608)_M]
R31  4R99  [RESC0603(1608)_M]
R32  100R  [RESC1206(3216)_L]
R33  100R  [RESC1206(3216)_L]
R34  10K  [RESC0603(1608)_M]
R35  10K  [RESC0603(1608)_M]
R36  100K  [RESC0603(1608)_M]
R37  100K  [RESC0603(1608)_M]
R38  4R99  [RESC0603(1608)_M]
R39  4R99  [RESC0603(1608)_M]
R40  100K  [RESC0603(1608)_M]
R41  100K  [RESC0603(1608)_M]
R42  100R  [RESC1206(3216)_L]
R43  100R  [RESC1206(3216)_L]
R44  10K  [RESC0603(1608)_M]
R45  10K  [RESC0603(1608)_M]
TP6  5001  [Keystone_5001]  (value not drawn)
TP7  5001  [Keystone_5001]  (value not drawn)
TP8  5001  [Keystone_5001]  (value not drawn)
TP9  5001  [Keystone_5001]  (value not drawn)
TP10  5001  [Keystone_5001]  (value not drawn)
TP11  5001  [Keystone_5001]  (value not drawn)
TP12  5001  [Keystone_5001]  (value not drawn)
TP13  5001  [Keystone_5001]  (value not drawn)
U6  TC4424AVOA713  [TC4424AVOA713]
U7  TC4424AVOA713  [TC4424AVOA713]
U8  TC4424AVOA713  [TC4424AVOA713]
U9  TC4424AVOA713  [TC4424AVOA713]

### Ports
LOW_SIDE_1_OUT (out), LOW_SIDE_1_SIG (in), LOW_SIDE_2_OUT (out), LOW_SIDE_2_SIG (in), LOW_SIDE_3_OUT (out), LOW_SIDE_3_SIG (in), LOW_SIDE_4_OUT (out), LOW_SIDE_4_SIG (in), LOW_SIDE_5_OUT (out), LOW_SIDE_5_SIG (in), LOW_SIDE_6_OUT (out), LOW_SIDE_6_SIG (in), LOW_SIDE_7_OUT (out), LOW_SIDE_7_SIG (in), LOW_SIDE_8_OUT (out), LOW_SIDE_8_SIG (in)

### Nets
5V: D3.A D5.A D7.A D8.A D11.A D13.A D15.A D16.A U6.6(VDD) U7.6(VDD) U8.6(VDD) U9.6(VDD)
GND: R20.1 R21.1 R24.1 R25.1 R36.1 R37.1 R40.1 R41.1 U6.3(GND) U7.3(GND) U8.3(GND) U9.3(GND)
INJ_GND: Q1.3(S) Q2.3(S) Q3.3(S) Q4.3(S) Q5.3(S) Q6.3(S) Q7.3(S) Q8.3(S) R18.1 R19.1 R28.1 R29.1 R34.1 R35.1 R44.1 R45.1
NetD3_C: D3.C R14.1
NetD4_1: D4.1(A) R14.2
NetD4_3: D4.3(K) Q1.4(D) ; port LOW_SIDE_3_OUT
NetD5_C: D5.C R15.1
NetD6_1: D6.1(A) R15.2
NetD6_3: D6.3(K) Q2.4(D) ; port LOW_SIDE_1_OUT
NetD7_C: D7.C R22.1
NetD8_C: D8.C R23.1
NetD9_1: D9.1(A) R22.2
NetD9_3: D9.3(K) Q3.4(D) ; port LOW_SIDE_2_OUT
NetD10_1: D10.1(A) R23.2
NetD10_3: D10.3(K) Q4.4(D) ; port LOW_SIDE_4_OUT
NetD11_C: D11.C R30.1
NetD12_1: D12.1(A) R30.2
NetD12_3: D12.3(K) Q5.4(D) ; port LOW_SIDE_7_OUT
NetD13_C: D13.C R31.1
NetD14_1: D14.1(A) R31.2
NetD14_3: D14.3(K) Q6.4(D) ; port LOW_SIDE_5_OUT
NetD15_C: D15.C R38.1
NetD16_C: D16.C R39.1
NetD17_1: D17.1(A) R38.2
NetD17_3: D17.3(K) Q7.4(D) ; port LOW_SIDE_6_OUT
NetD18_1: D18.1(A) R39.2
NetD18_3: D18.3(K) Q8.4(D) ; port LOW_SIDE_8_OUT
NetQ1_1: Q1.1(G) R16.2 R18.2
NetQ2_1: Q2.1(G) R17.2 R19.2
NetQ3_1: Q3.1(G) R26.2 R28.2
NetQ4_1: Q4.1(G) R27.2 R29.2
NetQ5_1: Q5.1(G) R32.2 R34.2
NetQ6_1: Q6.1(G) R33.2 R35.2
NetQ7_1: Q7.1(G) R42.2 R44.2
NetQ8_1: Q8.1(G) R43.2 R45.2
NetR16_1: R16.1 U7.7(OUTA)
NetR17_1: R17.1 U6.7(OUTA)
NetR20_2: R20.2 TP6.1(TP) U6.2(INA) ; port LOW_SIDE_1_SIG
NetR21_2: R21.2 TP7.1(TP) U7.2(INA) ; port LOW_SIDE_3_SIG
NetR24_2: R24.2 TP8.1(TP) U6.4(INB) ; port LOW_SIDE_2_SIG
NetR25_2: R25.2 TP9.1(TP) U7.4(INB) ; port LOW_SIDE_4_SIG
NetR26_1: R26.1 U6.5(OUTB)
NetR27_1: R27.1 U7.5(OUTB)
NetR32_1: R32.1 U9.7(OUTA)
NetR33_1: R33.1 U8.7(OUTA)
NetR36_2: R36.2 TP10.1(TP) U8.2(INA) ; port LOW_SIDE_5_SIG
NetR37_2: R37.2 TP11.1(TP) U9.2(INA) ; port LOW_SIDE_7_SIG
NetR40_2: R40.2 TP12.1(TP) U8.4(INB) ; port LOW_SIDE_6_SIG
NetR41_2: R41.2 TP13.1(TP) U9.4(INB) ; port LOW_SIDE_8_SIG
NetR42_1: R42.1 U8.5(OUTB)
NetR43_1: R43.1 U9.5(OUTB)

Not connected (* = marked no-connect by the designer): U6 1(NC)* 8(NC)*; U7 1(NC)* 8(NC); U8 1(NC)* 8(NC)*; U9 1(NC)* 8(NC)

### Notes on the sheet
- High Current Low-Side MOSFET Drivers 1&2
- High Current Low-Side MOSFET Drivers 3&4
- High Current Low-Side MOSFET Drivers 5&6
- High Current Low-Side MOSFET Drivers 7&8
- Sheet Title:
- Project Title:
- Engineer:
- Draftsman:
- Date:
- Size:
- B
- Revision:
- Sheet:        of

### Library data of the parts
D3 D5 D7 D8 D11 D13 D15 D16 = LTST-C194KRKT: Red 631nm LED Indication - Discrete 2V 0603 _1608 Metric_; MF: Lite-On Inc.; Digi-Key_Purchase_URL: https://www.digikey.com/product-detail/en/lite-on-inc/LTST-C194KRKT/160-1835-1-ND/2356232?utm_source=snapeda&utm_medium=aggregator&utm_campaign=symbol; MP: LTST-C194KRKT; Package: 0603 Lite-On; SnapEDA_Link: https://www.snapeda.com/parts/LTST-C194KRKT/Lite-On%20Inc./view-part/370565/?ref=snap; Digi-Key_Part_Number: 160-1835-1-ND; Value: *
D4 D6 D9 D10 D12 D14 D17 D18 = CMP-0648-00001-1: High-speed Switching Diode, 100 V, 4 ns, -65 to 150 degC, 3-Pin SOT23, RoHS, Tape and Reel; Manufacturer: NXP Semiconductors; Ptot (mW): 250; VFR (V): 1.75; VRRM (V): 100; Cd (pF): 1.5; Rth (j-t) (K/W): 330; trr (ns): 4; Rth (j-a) (K/W): 500; IF (mA): 215; ComponentLink1Description: Manufacturer URL; DatasheetVersion: Rev. 05; ComponentLink2Description: Datasheet; Temperature Range: -65 to 150 degC; RoHS: TRUE; PackageDescription: 3-Pin Plastic Surface-mounted Package, Body 1.3 x 2.9 mm, Pitch 0.95 mm; Packing: Tape and Reel; PartNumber: BAS16; ComponentLink1URL: http://www.nxp.com/; VR (V): 100; Mounting Technology: Surface Mount; ComponentLink2URL: http://www.nxp.com/documents/data_sheet/BAS16_SER.pdf; PackageReference: SOT23-3; IFRM (mA): 500
R14 R15 R22 R23 R30 R31 R38 R39 = CMP-1012-00250-1: 4R99 0.1W 1% 0603 (1608 Metric)  SMD; Value: 4.99 Ohm; Case-Metric: 1608; Case-EIA: 0603; Technology: SMT; Tolerance: 1 %; Power: 0.1 W
R16 R17 R26 R27 R32 R33 R42 R43 = CMP-1014-00397-1: 100R 0.25W 1% 1206 (3216 Metric)  SMD; Value: 100.00 Ohm; Case-Metric: 3216; Case-EIA: 1206; Technology: SMT; Tolerance: 1 %; Power: 0.25 W
R18 R19 R28 R29 R34 R35 R44 R45 = CMP-1012-00623-1: 10K 0.1W 1% 0603 (1608 Metric)  SMD; Value: 10000.00 Ohm; Case-EIA: 0603; Case-Metric: 1608; Power: 0.1 W; Tolerance: 1 %; Technology: SMT
R20 R21 R24 R25 R36 R37 R40 R41 = CMP-1012-00736-1: as R5 on sheet Power_Communications_MCU; Power: 0.1 W; Tolerance: 1 %; Technology: SMT
TP6-TP13 = TEST POINT: as TP1 on sheet Power_Communications_MCU; Supplier 1: Digi-Key; Manufacturer Part Number: 5001; RoHS: RoHS Compliant; Category: Test and Measurement; Stock 1: 7538; Pricing 1: 1=0.34, 10=0.315, 50=0.2296, 100=0.2206, 250=0.19812, 500=0.1891, 1000=0.15759, 2500=0.14408, 5000=0.13508 (USD); Packaging: Bulk; Type: PC Test Point, Miniature; Terminal: 0.010" x 0.020" (0.25mm x 0.51mm) Phosphor Bronze Wire, Silver Plated; Mounting Type: 0.040" (1.02mm) Hole Diameter; Material: Base, Nylon 46, UL 94V-0; Color: Black; ComponentLink1URL: http://www.keyelco.com/product-pdf.cfm?p=1310; ComponentLink1Description: http://www.keyelco.com/product-pdf.cfm?p=1310; Supplier Part Number 1: 5001K-ND

## Sheet Op_Amp_Sig_Process.SchDoc: Op-Amp Signal Pre-Processing
size B; SheetNumber: 4; SheetTotal: 5
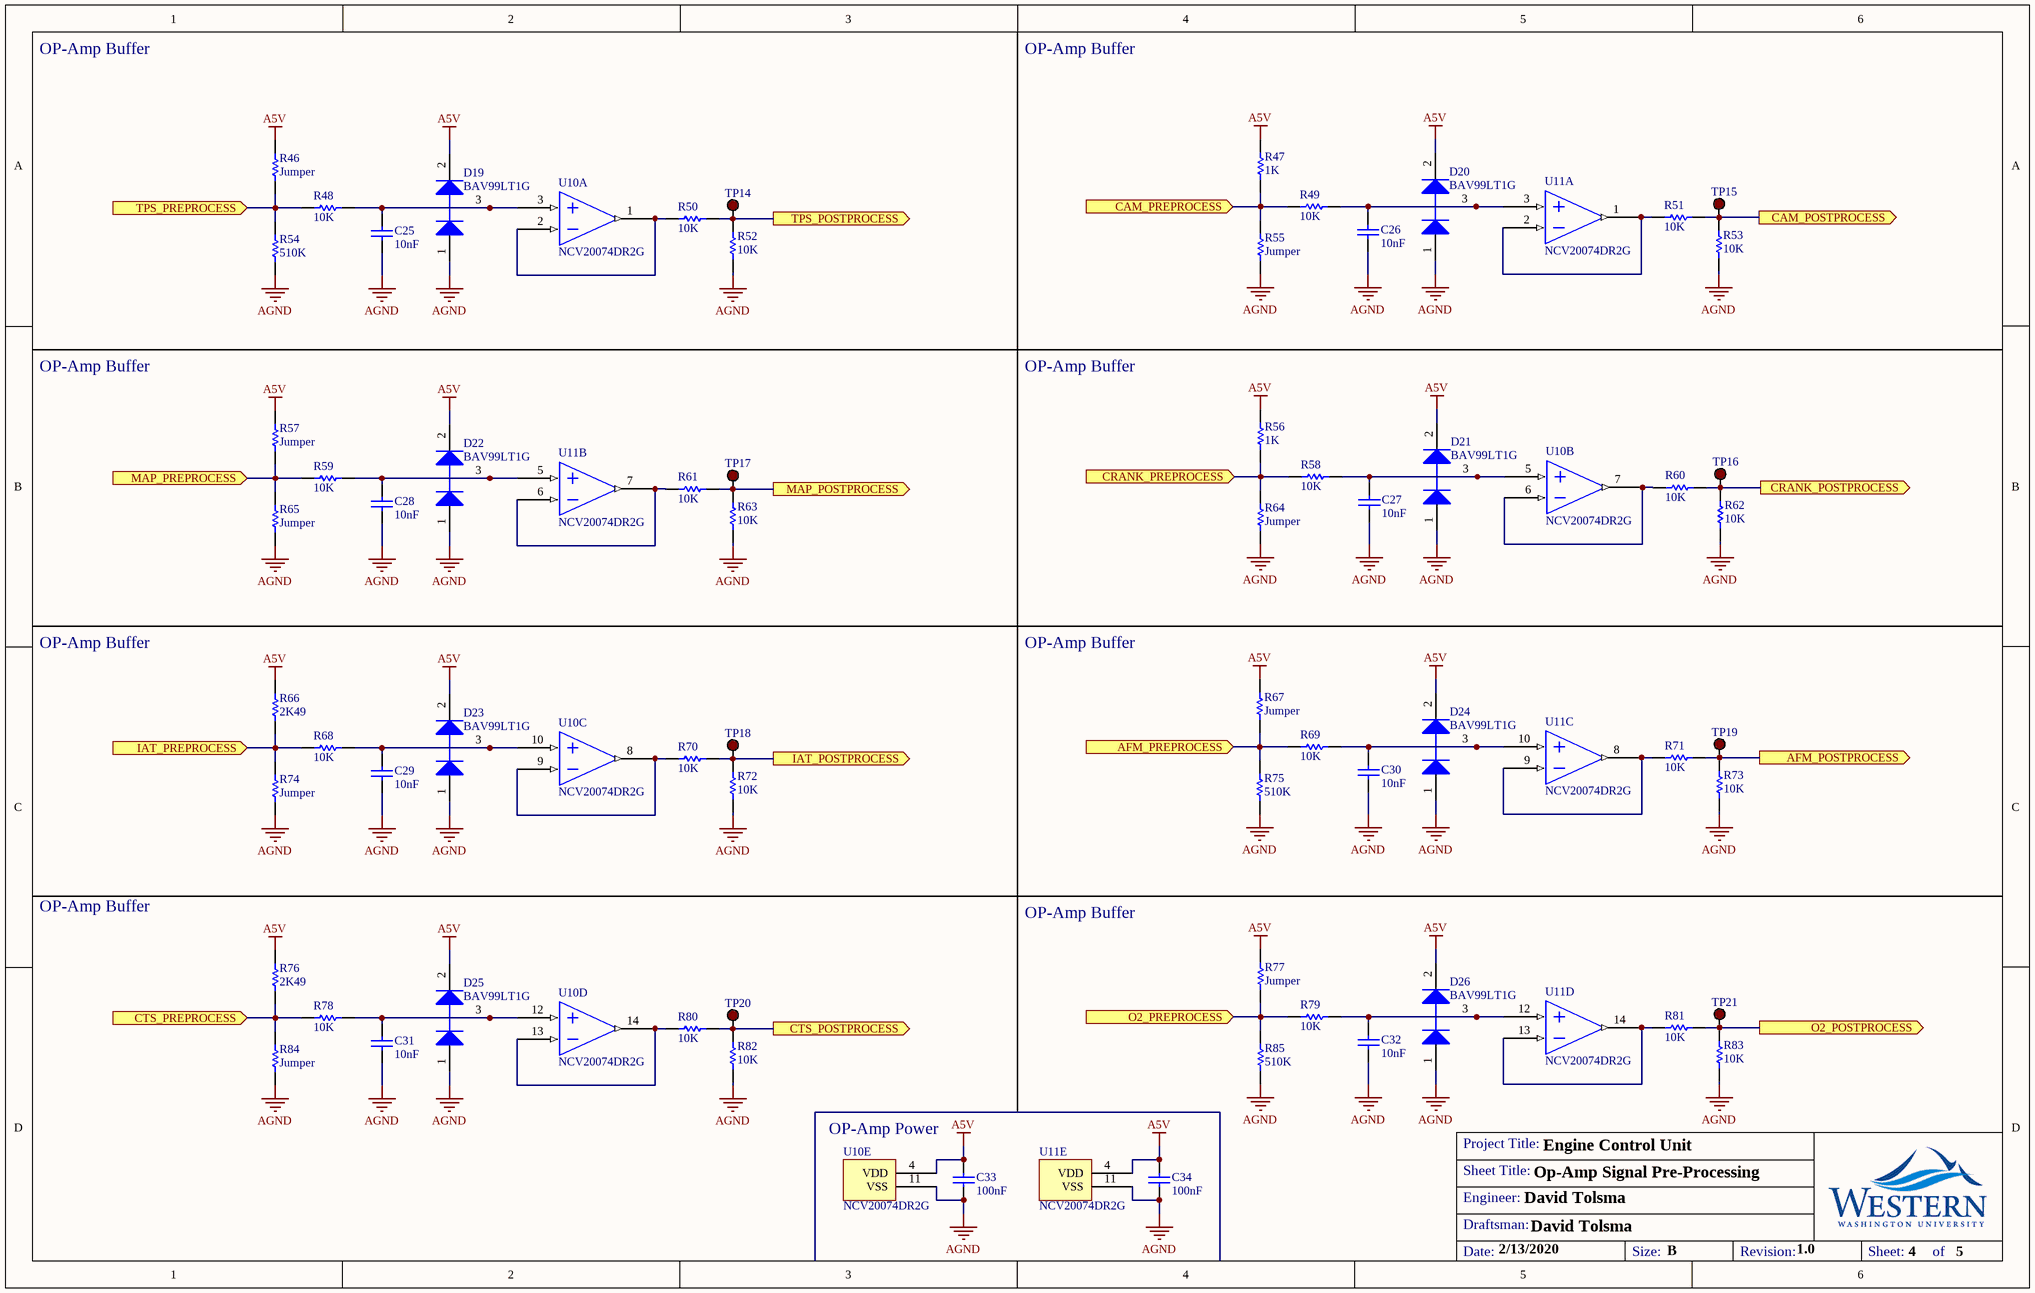
[diagram p2: Op_Amp_Sig_Process.SchDoc]

### Parts
C25  10nF  [CAPC0603(1608)100_M]
C26  10nF  [CAPC0603(1608)100_M]
C27  10nF  [CAPC0603(1608)100_M]
C28  10nF  [CAPC0603(1608)100_M]
C29  10nF  [CAPC0603(1608)100_M]
C30  10nF  [CAPC0603(1608)100_M]
C31  10nF  [CAPC0603(1608)100_M]
C32  10nF  [CAPC0603(1608)100_M]
C33  100nF  [CAPC0603(1608)100_M]
C34  100nF  [CAPC0603(1608)100_M]
D19  BAV99LT1G  [ONSC-SOT-23-3-318-08_V]
D20  BAV99LT1G  [ONSC-SOT-23-3-318-08_V]
D21  BAV99LT1G  [ONSC-SOT-23-3-318-08_V]
D22  BAV99LT1G  [ONSC-SOT-23-3-318-08_V]
D23  BAV99LT1G  [ONSC-SOT-23-3-318-08_V]
D24  BAV99LT1G  [ONSC-SOT-23-3-318-08_V]
D25  BAV99LT1G  [ONSC-SOT-23-3-318-08_V]
D26  BAV99LT1G  [ONSC-SOT-23-3-318-08_V]
R46  Jumper  [RESC0603(1608)_M]
R47  1K  [RESC0603(1608)_M]
R48  10K  [RESC0603(1608)_M]
R49  10K  [RESC0603(1608)_M]
R50  10K  [RESC0603(1608)_M]
R51  10K  [RESC0603(1608)_M]
R52  10K  [RESC0603(1608)_M]
R53  10K  [RESC0603(1608)_M]
R54  510K  [RESC0603(1608)_M]
R55  Jumper  [RESC0603(1608)_M]
R56  1K  [RESC0603(1608)_M]
R57  Jumper  [RESC0603(1608)_M]
R58  10K  [RESC0603(1608)_M]
R59  10K  [RESC0603(1608)_M]
R60  10K  [RESC0603(1608)_M]
R61  10K  [RESC0603(1608)_M]
R62  10K  [RESC0603(1608)_M]
R63  10K  [RESC0603(1608)_M]
R64  Jumper  [RESC0603(1608)_M]
R65  Jumper  [RESC0603(1608)_M]
R66  2K49  [RESC0603(1608)_M]
R67  Jumper  [RESC0603(1608)_M]
R68  10K  [RESC0603(1608)_M]
R69  10K  [RESC0603(1608)_M]
R70  10K  [RESC0603(1608)_M]
R71  10K  [RESC0603(1608)_M]
R72  10K  [RESC0603(1608)_M]
R73  10K  [RESC0603(1608)_M]
R74  Jumper  [RESC0603(1608)_M]
R75  510K  [RESC0603(1608)_M]
R76  2K49  [RESC0603(1608)_M]
R77  Jumper  [RESC0603(1608)_M]
R78  10K  [RESC0603(1608)_M]
R79  10K  [RESC0603(1608)_M]
R80  10K  [RESC0603(1608)_M]
R81  10K  [RESC0603(1608)_M]
R82  10K  [RESC0603(1608)_M]
R83  10K  [RESC0603(1608)_M]
R84  Jumper  [RESC0603(1608)_M]
R85  510K  [RESC0603(1608)_M]
TP14  5001  [Keystone_5001]  (value not drawn)
TP15  5001  [Keystone_5001]  (value not drawn)
TP16  5001  [Keystone_5001]  (value not drawn)
TP17  5001  [Keystone_5001]  (value not drawn)
TP18  5001  [Keystone_5001]  (value not drawn)
TP19  5001  [Keystone_5001]  (value not drawn)
TP20  5001  [Keystone_5001]  (value not drawn)
TP21  5001  [Keystone_5001]  (value not drawn)
U10  NCV20074DR2G  [NCV20074DR2G]  (parts A,B,C,D,E of 5)
U11  NCV20074DR2G  [NCV20074DR2G]  (parts A,B,C,D,E of 5)

### Ports
AFM_POSTPROCESS (out), AFM_PREPROCESS (in), CAM_POSTPROCESS (out), CAM_PREPROCESS (in), CRANK_POSTPROCESS (out), CRANK_PREPROCESS (in), CTS_POSTPROCESS (out), CTS_PREPROCESS (in), IAT_POSTPROCESS (out), IAT_PREPROCESS (in), MAP_POSTPROCESS (out), MAP_PREPROCESS (in), O2_POSTPROCESS (out), O2_PREPROCESS (in), TPS_POSTPROCESS (out), TPS_PREPROCESS (in)

### Nets
A5V: C33.2 C34.2 D19.2(K) D20.2(K) D21.2(K) D22.2(K) D23.2(K) D24.2(K) D25.2(K) D26.2(K) R46.2 R47.2 R56.2 R57.2 R66.2 R67.2 R76.2 R77.2 U10.4(VDD) U11.4(VDD)
AGND: C25.1 C26.1 C27.1 C28.1 C29.1 C30.1 C31.1 C32.1 C33.1 C34.1 D19.1(A) D20.1(A) D21.1(A) D22.1(A) D23.1(A) D24.1(A) D25.1(A) D26.1(A) R52.1 R53.1 R54.1 R55.1 R62.1 R63.1 R64.1 R65.1 R72.1 R73.1 R74.1 R75.1 R82.1 R83.1 R84.1 R85.1 U10.11(VSS) U11.11(VSS)
NetC25_2: C25.2 D19.3(K/A) R48.2 U10.3(IN1+)
NetC26_2: C26.2 D20.3(K/A) R49.2 U11.3(IN1+)
NetC27_2: C27.2 D21.3(K/A) R58.2 U10.5(IN2+)
NetC28_2: C28.2 D22.3(K/A) R59.2 U11.5(IN2+)
NetC29_2: C29.2 D23.3(K/A) R68.2 U10.10(IN3+)
NetC30_2: C30.2 D24.3(K/A) R69.2 U11.10(IN3+)
NetC31_2: C31.2 D25.3(K/A) R78.2 U10.12(IN4+)
NetC32_2: C32.2 D26.3(K/A) R79.2 U11.12(IN4+)
NetJ3_18: R76.1 R78.1 R84.2 ; port CTS_PREPROCESS
NetJ3_19: R67.1 R69.1 R75.2 ; port AFM_PREPROCESS
NetJ3_20: R46.1 R48.1 R54.2 ; port TPS_PREPROCESS
NetJ3_23: R56.1 R58.1 R64.2 ; port CRANK_PREPROCESS
NetJ3_24: R47.1 R49.1 R55.2 ; port CAM_PREPROCESS
NetJ3_27: R66.1 R68.1 R74.2 ; port IAT_PREPROCESS
NetJ3_28: R77.1 R79.1 R85.2 ; port O2_PREPROCESS
NetR50_1: R50.1 U10.1(OUT1) U10.2(IN1-)
NetR50_2: R50.2 R52.2 TP14.1(TP) ; port TPS_POSTPROCESS
NetR51_1: R51.1 U11.1(OUT1) U11.2(IN1-)
NetR51_2: R51.2 R53.2 TP15.1(TP) ; port CAM_POSTPROCESS
NetR57_1: R57.1 R59.1 R65.2 ; port MAP_PREPROCESS
NetR60_1: R60.1 U10.6(IN2-) U10.7(OUT2)
NetR60_2: R60.2 R62.2 TP16.1(TP) ; port CRANK_POSTPROCESS
NetR61_1: R61.1 U11.6(IN2-) U11.7(OUT2)
NetR61_2: R61.2 R63.2 TP17.1(TP) ; port MAP_POSTPROCESS
NetR70_1: R70.1 U10.8(OUT3) U10.9(IN3-)
NetR70_2: R70.2 R72.2 TP18.1(TP) ; port IAT_POSTPROCESS
NetR71_1: R71.1 U11.8(OUT3) U11.9(IN3-)
NetR71_2: R71.2 R73.2 TP19.1(TP) ; port AFM_POSTPROCESS
NetR80_1: R80.1 U10.13(IN4-) U10.14(OUT4)
NetR80_2: R80.2 R82.2 TP20.1(TP) ; port CTS_POSTPROCESS
NetR81_1: R81.1 U11.13(IN4-) U11.14(OUT4)
NetR81_2: R81.2 R83.2 TP21.1(TP) ; port O2_POSTPROCESS

### Notes on the sheet
- OP-Amp Buffer
- OP-Amp Power
- Sheet Title:
- Project Title:
- Engineer:
- Draftsman:
- Date:
- Size:
- B
- Revision:
- Sheet:        of

### Library data of the parts
C25-C32 = CMP-1035-02320-1: CAP 10nF 50V ±5% 0603 (1608 Metric) Thickness 1mm SMD; Case-EIA: 0603; Tolerance: Â±5%; Case-Metric: 1608; Value: 10nF; Max Thickness: 1 mm; Technology: SMT; Rated Voltage: 50 V
C33 C34 = CMP-1035-02580-1: as C13 on sheet Power_Communications_MCU; Max Thickness: 1 mm; Value: 100nF; Rated Voltage: 10 V; Technology: SMT
D19-D26 = CMP-1054-00085-1: Dual Series Switching Diodes, 3-Pin SOT-23, Pb-Free, Tape and Reel; Manufacturer: On Semiconductor; trr Max (ns): 6; IF Max (A): 0.215; Configuration: Dual Series; PackageDescription: 3-Pin Small Outline Transistor, Body 2.92 x 1.3 mm, Pitch 0.95 mm; PackageVersion: Rev. AP, 11/2009; ComponentLink1Description: Manufacturer URL; RoHS: TRUE; PartNumber: BAV99LT1G; ComponentLink3URL: http://www.onsemi.cn/pub_link/Collateral/318-08.PDF; DatasheetVersion: Rev. 9; PackageReference: SOT-23-3-318-08; ComponentLink2Description: Datasheet; Packing: Tape and Reel; Mounting Technology: Surface Mount; ComponentLink1URL: http://www.onsemi.com/; ComponentLink3Description: Package Specification; ComponentLink2URL: http://www.onsemi.cn/pub_link/Collateral/BAV99LT1-D.PDF
R46 R55 R57 R64 R65 R67 R74 R77 R84 = CMP-1012-00001-1: as R1 on sheet Power_Communications_MCU; Technology: SMT; Tolerance: None
R47 R56 = CMP-1012-00510-1: 1K 0.1W 1% 0603 (1608 Metric)  SMD; Case-Metric: 1608; Case-EIA: 0603; Value: 1000.00 Ohm; Technology: SMT; Tolerance: 1 %; Power: 0.1 W
R48-R53 R58-R63 R68-R73 R78-R83 = CMP-1012-00623-1: as R18 on sheet Low_Side_Drivers; Power: 0.1 W; Tolerance: 1 %; Technology: SMT
R54 R75 R85 = CMP-1012-00816-1: as R11 on sheet Power_Communications_MCU; Tolerance: 1 %; Technology: SMT; Power: 0.1 W
R66 R76 = CMP-1012-00553-1: 2K49 0.1W 1% 0603 (1608 Metric)  SMD; Case-EIA: 0603; Value: 2490.00 Ohm; Case-Metric: 1608; Tolerance: 1 %; Technology: SMT; Power: 0.1 W
TP14-TP21 = TEST POINT: as TP1 on sheet Power_Communications_MCU; Supplier 1: Digi-Key; Manufacturer Part Number: 5001; RoHS: RoHS Compliant; Category: Test and Measurement; Stock 1: 7538; Pricing 1: 1=0.34, 10=0.315, 50=0.2296, 100=0.2206, 250=0.19812, 500=0.1891, 1000=0.15759, 2500=0.14408, 5000=0.13508 (USD); Packaging: Bulk; Type: PC Test Point, Miniature; Terminal: 0.010" x 0.020" (0.25mm x 0.51mm) Phosphor Bronze Wire, Silver Plated; Mounting Type: 0.040" (1.02mm) Hole Diameter; Material: Base, Nylon 46, UL 94V-0; Color: Black; ComponentLink1URL: http://www.keyelco.com/product-pdf.cfm?p=1310; ComponentLink1Description: http://www.keyelco.com/product-pdf.cfm?p=1310; Supplier Part Number 1: 5001K-ND

## Sheet Push_Pull_Drivers.SchDoc: Push Pull Drivers
size B; SheetNumber: 3; SheetTotal: 5
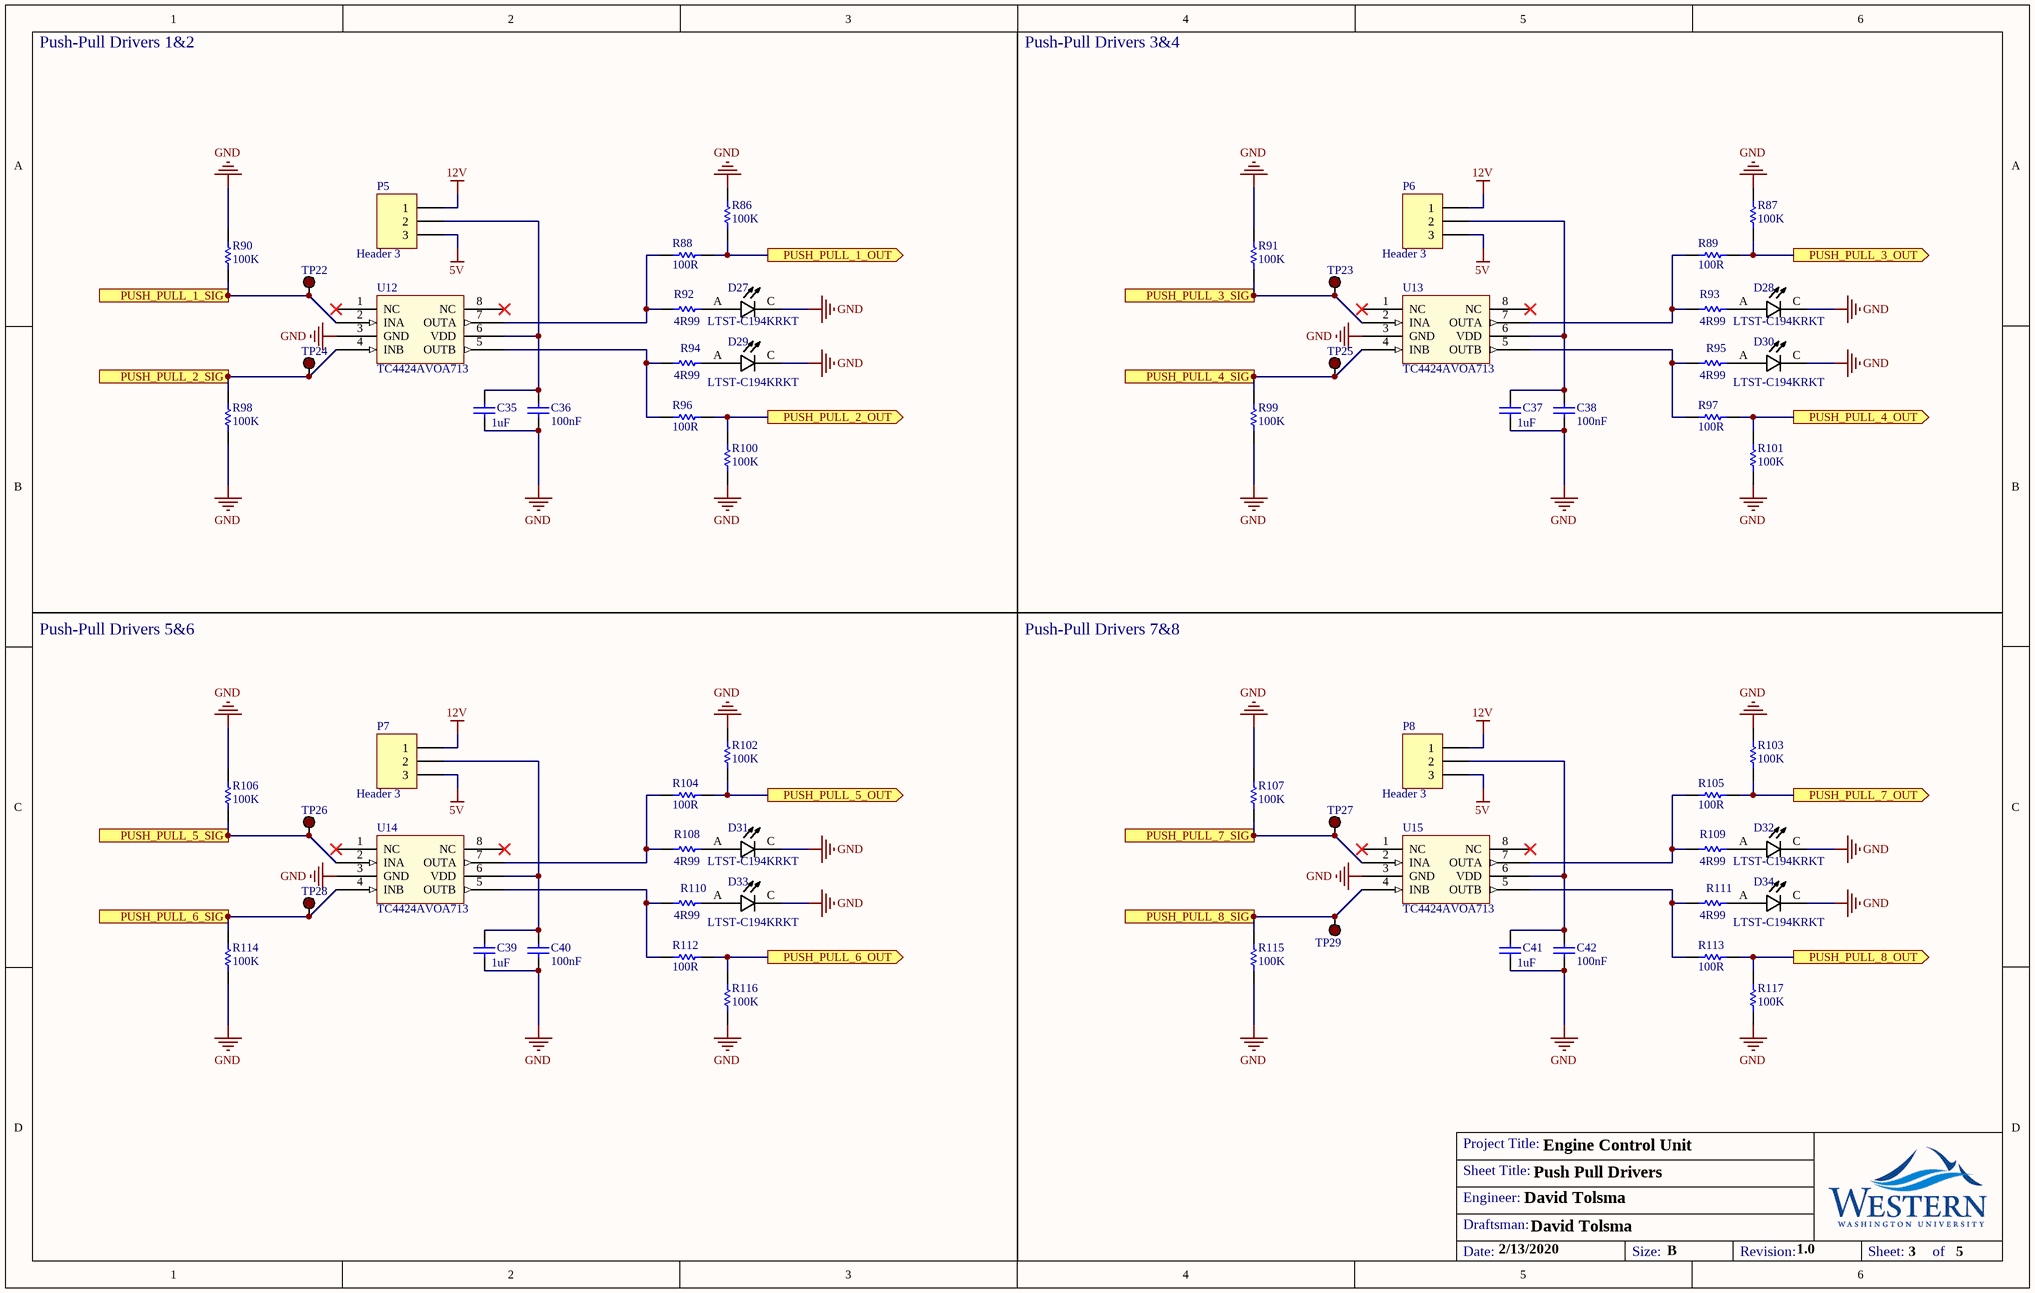
[diagram p3: Push_Pull_Drivers.SchDoc]

### Parts
C35  1uF  [CAPC0603(1608)100_M]
C36  100nF  [CAPC0603(1608)100_M]
C37  1uF  [CAPC0603(1608)100_M]
C38  100nF  [CAPC0603(1608)100_M]
C39  1uF  [CAPC0603(1608)100_M]
C40  100nF  [CAPC0603(1608)100_M]
C41  1uF  [CAPC0603(1608)100_M]
C42  100nF  [CAPC0603(1608)100_M]
D27  LTST-C194KRKT  [LEDC1608X35N_LTST-C194KRKT]
D28  LTST-C194KRKT  [LEDC1608X35N_LTST-C194KRKT]
D29  LTST-C194KRKT  [LEDC1608X35N_LTST-C194KRKT]
D30  LTST-C194KRKT  [LEDC1608X35N_LTST-C194KRKT]
D31  LTST-C194KRKT  [LEDC1608X35N_LTST-C194KRKT]
D32  LTST-C194KRKT  [LEDC1608X35N_LTST-C194KRKT]
D33  LTST-C194KRKT  [LEDC1608X35N_LTST-C194KRKT]
D34  LTST-C194KRKT  [LEDC1608X35N_LTST-C194KRKT]
P5  Header 3  [HDR1X3]
P6  Header 3  [HDR1X3]
P7  Header 3  [HDR1X3]
P8  Header 3  [HDR1X3]
R86  100K  [RESC0603(1608)_M]
R87  100K  [RESC0603(1608)_M]
R88  100R  [RESC1206(3216)_L]
R89  100R  [RESC1206(3216)_L]
R90  100K  [RESC0603(1608)_M]
R91  100K  [RESC0603(1608)_M]
R92  4R99  [RESC0603(1608)_M]
R93  4R99  [RESC0603(1608)_M]
R94  4R99  [RESC0603(1608)_M]
R95  4R99  [RESC0603(1608)_M]
R96  100R  [RESC1206(3216)_L]
R97  100R  [RESC1206(3216)_L]
R98  100K  [RESC0603(1608)_M]
R99  100K  [RESC0603(1608)_M]
R100  100K  [RESC0603(1608)_M]
R101  100K  [RESC0603(1608)_M]
R102  100K  [RESC0603(1608)_M]
R103  100K  [RESC0603(1608)_M]
R104  100R  [RESC1206(3216)_L]
R105  100R  [RESC1206(3216)_L]
R106  100K  [RESC0603(1608)_M]
R107  100K  [RESC0603(1608)_M]
R108  4R99  [RESC0603(1608)_M]
R109  4R99  [RESC0603(1608)_M]
R110  4R99  [RESC0603(1608)_M]
R111  4R99  [RESC0603(1608)_M]
R112  100R  [RESC1206(3216)_L]
R113  100R  [RESC1206(3216)_L]
R114  100K  [RESC0603(1608)_M]
R115  100K  [RESC0603(1608)_M]
R116  100K  [RESC0603(1608)_M]
R117  100K  [RESC0603(1608)_M]
TP22  5001  [Keystone_5001]  (value not drawn)
TP23  5001  [Keystone_5001]  (value not drawn)
TP24  5001  [Keystone_5001]  (value not drawn)
TP25  5001  [Keystone_5001]  (value not drawn)
TP26  5001  [Keystone_5001]  (value not drawn)
TP27  5001  [Keystone_5001]  (value not drawn)
TP28  5001  [Keystone_5001]  (value not drawn)
TP29  5001  [Keystone_5001]  (value not drawn)
U12  TC4424AVOA713  [TC4424AVOA713]
U13  TC4424AVOA713  [TC4424AVOA713]
U14  TC4424AVOA713  [TC4424AVOA713]
U15  TC4424AVOA713  [TC4424AVOA713]

### Ports
PUSH_PULL_1_OUT (out), PUSH_PULL_1_SIG (in), PUSH_PULL_2_OUT (out), PUSH_PULL_2_SIG (in), PUSH_PULL_3_OUT (out), PUSH_PULL_3_SIG (in), PUSH_PULL_4_OUT (out), PUSH_PULL_4_SIG (in), PUSH_PULL_5_OUT (out), PUSH_PULL_5_SIG (in), PUSH_PULL_6_OUT (out), PUSH_PULL_6_SIG (in), PUSH_PULL_7_OUT (out), PUSH_PULL_7_SIG (in), PUSH_PULL_8_OUT (out), PUSH_PULL_8_SIG (in)

### Nets
5V: P5.3 P6.3 P7.3 P8.3
12V: P5.1 P6.1 P7.1 P8.1
GND: C35.1 C36.1 C37.1 C38.1 C39.1 C40.1 C41.1 C42.1 D27.C D28.C D29.C D30.C D31.C D32.C D33.C D34.C R86.2 R87.2 R90.1 R91.1 R98.1 R99.1 R100.1 R101.1 R102.2 R103.2 R106.1 R107.1 R114.1 R115.1 R116.1 R117.1 U12.3(GND) U13.3(GND) U14.3(GND) U15.3(GND)
NetC35_2: C35.2 C36.2 P5.2 U12.6(VDD)
NetC37_2: C37.2 C38.2 P6.2 U13.6(VDD)
NetC39_2: C39.2 C40.2 P7.2 U14.6(VDD)
NetC41_2: C41.2 C42.2 P8.2 U15.6(VDD)
NetD27_A: D27.A R92.2
NetD28_A: D28.A R93.2
NetD29_A: D29.A R94.2
NetD30_A: D30.A R95.2
NetD31_A: D31.A R108.2
NetD32_A: D32.A R109.2
NetD33_A: D33.A R110.2
NetD34_A: D34.A R111.2
NetJ3_43: R113.2 R117.2 ; port PUSH_PULL_8_OUT
NetJ3_44: R103.1 R105.2 ; port PUSH_PULL_7_OUT
NetJ3_45: R112.2 R116.2 ; port PUSH_PULL_6_OUT
NetJ3_46: R102.1 R104.2 ; port PUSH_PULL_5_OUT
NetJ3_47: R97.2 R101.2 ; port PUSH_PULL_4_OUT
NetJ3_48: R87.1 R89.2 ; port PUSH_PULL_3_OUT
NetJ3_55: R86.1 R88.2 ; port PUSH_PULL_1_OUT
NetJ3_63: R96.2 R100.2 ; port PUSH_PULL_2_OUT
NetR88_1: R88.1 R92.1 U12.7(OUTA)
NetR89_1: R89.1 R93.1 U13.7(OUTA)
NetR90_2: R90.2 TP22.1(TP) U12.2(INA) ; port PUSH_PULL_1_SIG
NetR91_2: R91.2 TP23.1(TP) U13.2(INA) ; port PUSH_PULL_3_SIG
NetR94_1: R94.1 R96.1 U12.5(OUTB)
NetR95_1: R95.1 R97.1 U13.5(OUTB)
NetR98_2: R98.2 TP24.1(TP) U12.4(INB) ; port PUSH_PULL_2_SIG
NetR99_2: R99.2 TP25.1(TP) U13.4(INB) ; port PUSH_PULL_4_SIG
NetR104_1: R104.1 R108.1 U14.7(OUTA)
NetR105_1: R105.1 R109.1 U15.7(OUTA)
NetR106_2: R106.2 TP26.1(TP) U14.2(INA) ; port PUSH_PULL_5_SIG
NetR107_2: R107.2 TP27.1(TP) U15.2(INA) ; port PUSH_PULL_7_SIG
NetR110_1: R110.1 R112.1 U14.5(OUTB)
NetR111_1: R111.1 R113.1 U15.5(OUTB)
NetR114_2: R114.2 TP28.1(TP) U14.4(INB) ; port PUSH_PULL_6_SIG
NetR115_2: R115.2 TP29.1(TP) U15.4(INB) ; port PUSH_PULL_8_SIG

Not connected (* = marked no-connect by the designer): U12 1(NC)* 8(NC)*; U13 1(NC)* 8(NC)*; U14 1(NC)* 8(NC)*; U15 1(NC)* 8(NC)*

### Notes on the sheet
- Push-Pull Drivers 1&2
- Push-Pull Drivers 3&4
- Push-Pull Drivers 5&6
- Push-Pull Drivers 7&8
- Sheet Title:
- Project Title:
- Engineer:
- Draftsman:
- Date:
- Size:
- B
- Revision:
- Sheet:        of

### Library data of the parts
C35 C37 C39 C41 = CMP-1035-02745-1: as C7 on sheet Power_Communications_MCU; Technology: SMT; Value: 1uF; Rated Voltage: 50 V; Max Thickness: 1 mm
C36 C38 C40 C42 = CMP-1035-02592-1: CAP 100nF 50V ±10% 0603 (1608 Metric) Thickness 1mm SMD; Case-EIA: 0603; Case-Metric: 1608; Tolerance: Â±10%; Technology: SMT; Rated Voltage: 50 V; Max Thickness: 1 mm; Value: 100nF
D27-D34 = LTST-C194KRKT: as D3 on sheet Low_Side_Drivers; Digi-Key_Purchase_URL: https://www.digikey.com/product-detail/en/lite-on-inc/LTST-C194KRKT/160-1835-1-ND/2356232?utm_source=snapeda&utm_medium=aggregator&utm_campaign=symbol; MP: LTST-C194KRKT; Package: 0603 Lite-On; SnapEDA_Link: https://www.snapeda.com/parts/LTST-C194KRKT/Lite-On%20Inc./view-part/370565/?ref=snap; Digi-Key_Part_Number: 160-1835-1-ND; Value: *
P5-P8 = Header 3: Header, 3-Pin; LatestRevisionDate: 17-Jul-2002; LatestRevisionNote: Re-released for DXP Platform.; Publisher: Altium Limited
R86 R87 R90 R91 R98-R103 R106 R107 R114-R117 = CMP-1012-00736-1: as R5 on sheet Power_Communications_MCU; Power: 0.1 W; Tolerance: 1 %; Technology: SMT
R88 R89 R96 R97 R104 R105 R112 R113 = CMP-1014-00397-1: as R16 on sheet Low_Side_Drivers; Technology: SMT; Tolerance: 1 %; Power: 0.25 W
R92-R95 R108-R111 = CMP-1012-00250-1: as R14 on sheet Low_Side_Drivers; Technology: SMT; Tolerance: 1 %; Power: 0.1 W
TP22-TP29 = TEST POINT: as TP1 on sheet Power_Communications_MCU; Supplier 1: Digi-Key; Manufacturer Part Number: 5001; RoHS: RoHS Compliant; Category: Test and Measurement; Stock 1: 7538; Pricing 1: 1=0.34, 10=0.315, 50=0.2296, 100=0.2206, 250=0.19812, 500=0.1891, 1000=0.15759, 2500=0.14408, 5000=0.13508 (USD); Packaging: Bulk; Type: PC Test Point, Miniature; Terminal: 0.010" x 0.020" (0.25mm x 0.51mm) Phosphor Bronze Wire, Silver Plated; Mounting Type: 0.040" (1.02mm) Hole Diameter; Material: Base, Nylon 46, UL 94V-0; Color: Black; ComponentLink1URL: http://www.keyelco.com/product-pdf.cfm?p=1310; ComponentLink1Description: http://www.keyelco.com/product-pdf.cfm?p=1310; Supplier Part Number 1: 5001K-ND